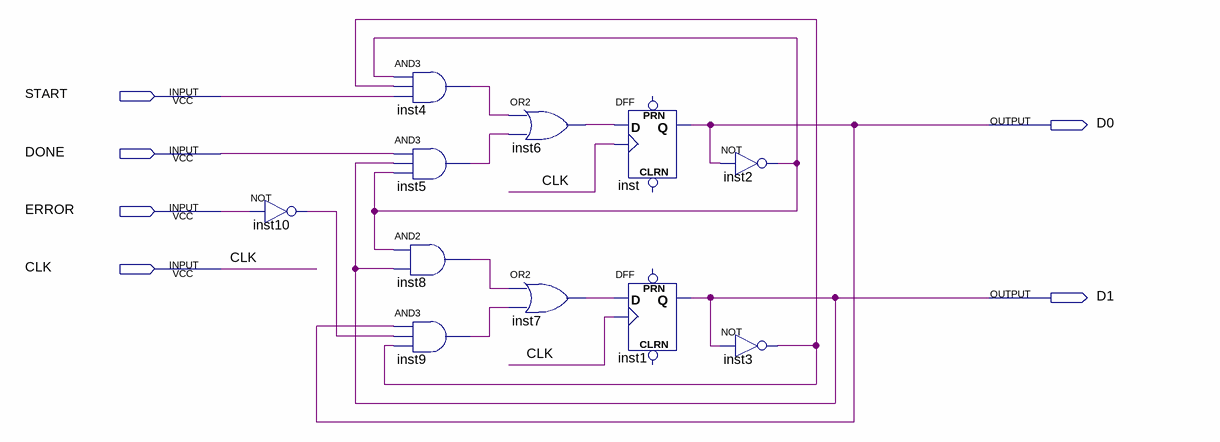
[diagram p0: schematic sheet]
// Quartus schematic FSM_DIV.bdf as structural Verilog: 11 symbols, 6 pins
module FSM_DIV (
  input  START,
  input  DONE,
  input  ERROR,
  input  CLK,
  output D0,
  output D1
);

  wire inst2_out, inst3_out, inst4_out, inst5_out, inst6_out, inst7_out, inst8_out, inst9_out, inst10_out;

  not inst10 (inst10_out, ERROR);
  and inst4 (inst4_out, inst2_out, inst3_out, START);
  and inst5 (inst5_out, DONE, D1, inst2_out);
  and inst8 (inst8_out, inst2_out, D1);
  and inst9 (inst9_out, D0, inst10_out, inst3_out);
  or inst6 (inst6_out, inst4_out, inst5_out);
  or inst7 (inst7_out, inst8_out, inst9_out);
  DFF inst (.CLK(CLK), .D(inst6_out), .Q(D0));  // open: CLRN, PRN
  DFF inst1 (.CLK(CLK), .D(inst7_out), .Q(D1));  // open: CLRN, PRN
  not inst2 (inst2_out, D0);
  not inst3 (inst3_out, D1);
endmodule
